# Altium project Audio Prj.PrjPcb
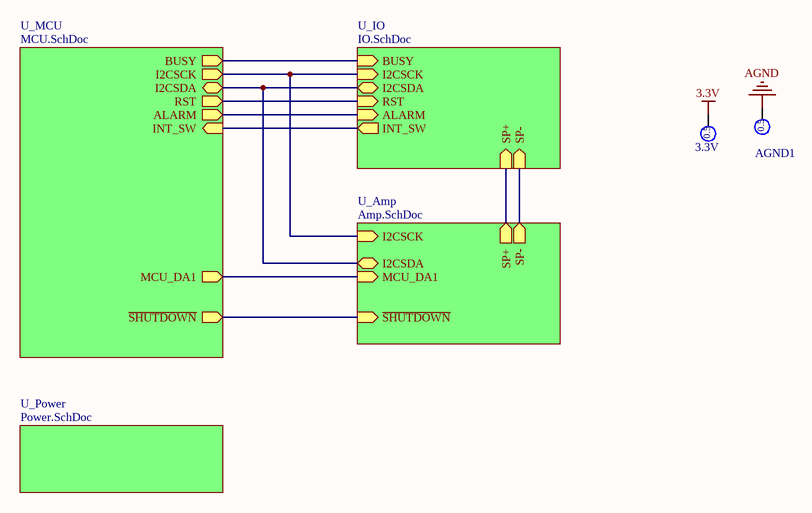
[diagram p0: TOP.SchDoc]
PRJ_Number: 202107; PRJ_Title: IHA-8001; SCH_Rev: 1.0
5 sheets, 279 parts. Net scope: hierarchical (ports join the sheet entries above them; power ports are global).
Board file: PCB2.PcbDoc
Sheets:
  TOP.SchDoc
    U_Amp = Amp.SchDoc
    U_MCU = MCU.SchDoc
    U_Power = Power.SchDoc
    U_IO = IO.SchDoc

## Sheet TOP.SchDoc: CX1000 5V4A
size A4; Date: 2012/02/27; ApprovedBy: 稲村; DrawnBy: 猪鼻; DocumentNumber: Documentnumber; Revision: 1; SheetNumber: 1; SheetTotal: 5; BoardNumber: BoardNumber; PartsNumber: PartsNumber; DrawnDate: 2012/02/27; ApprovedDate: 2012/**/**

### Parts
3.3V  TP0.5mm  [TP0.5mm]  (value not drawn)  (no BOM)
AGND1  TP0.5mm  [TP0.5mm]  (value not drawn)  (no BOM)

### Sub-sheets
U_Amp = Amp.SchDoc: SP+ (out), SP- (out), MCU_DA1 (in), ~{SHUTDOWN} (in), I2CSCK (in), I2CSDA (bidir)
U_IO = IO.SchDoc: SP+ (in), SP- (in), BUSY (in), I2CSCK (in), I2CSDA (bidir), INT_SW (out), RST (in), ALARM (in)
U_MCU = MCU.SchDoc: I2CSCK (out), I2CSDA (bidir), ALARM (out), BUSY (out), MCU_DA1 (out), RST (out), INT_SW (in), ~{SHUTDOWN} (out)
U_Power = Power.SchDoc: no entries

### Nets
3.3V: 3.3V.1
AGND: AGND1.1
ALARM: sheet U_MCU/ALARM, sheet U_IO/ALARM
BUSY: sheet U_MCU/BUSY, sheet U_IO/BUSY
I2CSCK: sheet U_Amp/I2CSCK, sheet U_MCU/I2CSCK, sheet U_IO/I2CSCK
I2CSDA: sheet U_Amp/I2CSDA, sheet U_MCU/I2CSDA, sheet U_IO/I2CSDA
INT_SW: sheet U_MCU/INT_SW, sheet U_IO/INT_SW
SP+: sheet U_Amp/SP+, sheet U_IO/SP+
SP-: sheet U_Amp/SP-, sheet U_IO/SP-
NetC58_1: sheet U_Amp/MCU_DA1, sheet U_MCU/MCU_DA1
NetR123_1: sheet U_Amp/~{SHUTDOWN}, sheet U_MCU/~{SHUTDOWN}
NetU2_44: sheet U_MCU/RST, sheet U_IO/RST

### Notes on the sheet
- Project Title:
- Project No:
- Size:
- Date:
- A4
- Rev:
- Page Title:
- Sheet:
- of
- (in symbol TP0.5mm) 0.5

### Library data of the parts
3.3V AGND1 = TP0.5mm: Test-Point 0.5mm

## Sheet Amp.SchDoc
size A4; SheetNumber: 4; SheetTotal: 5
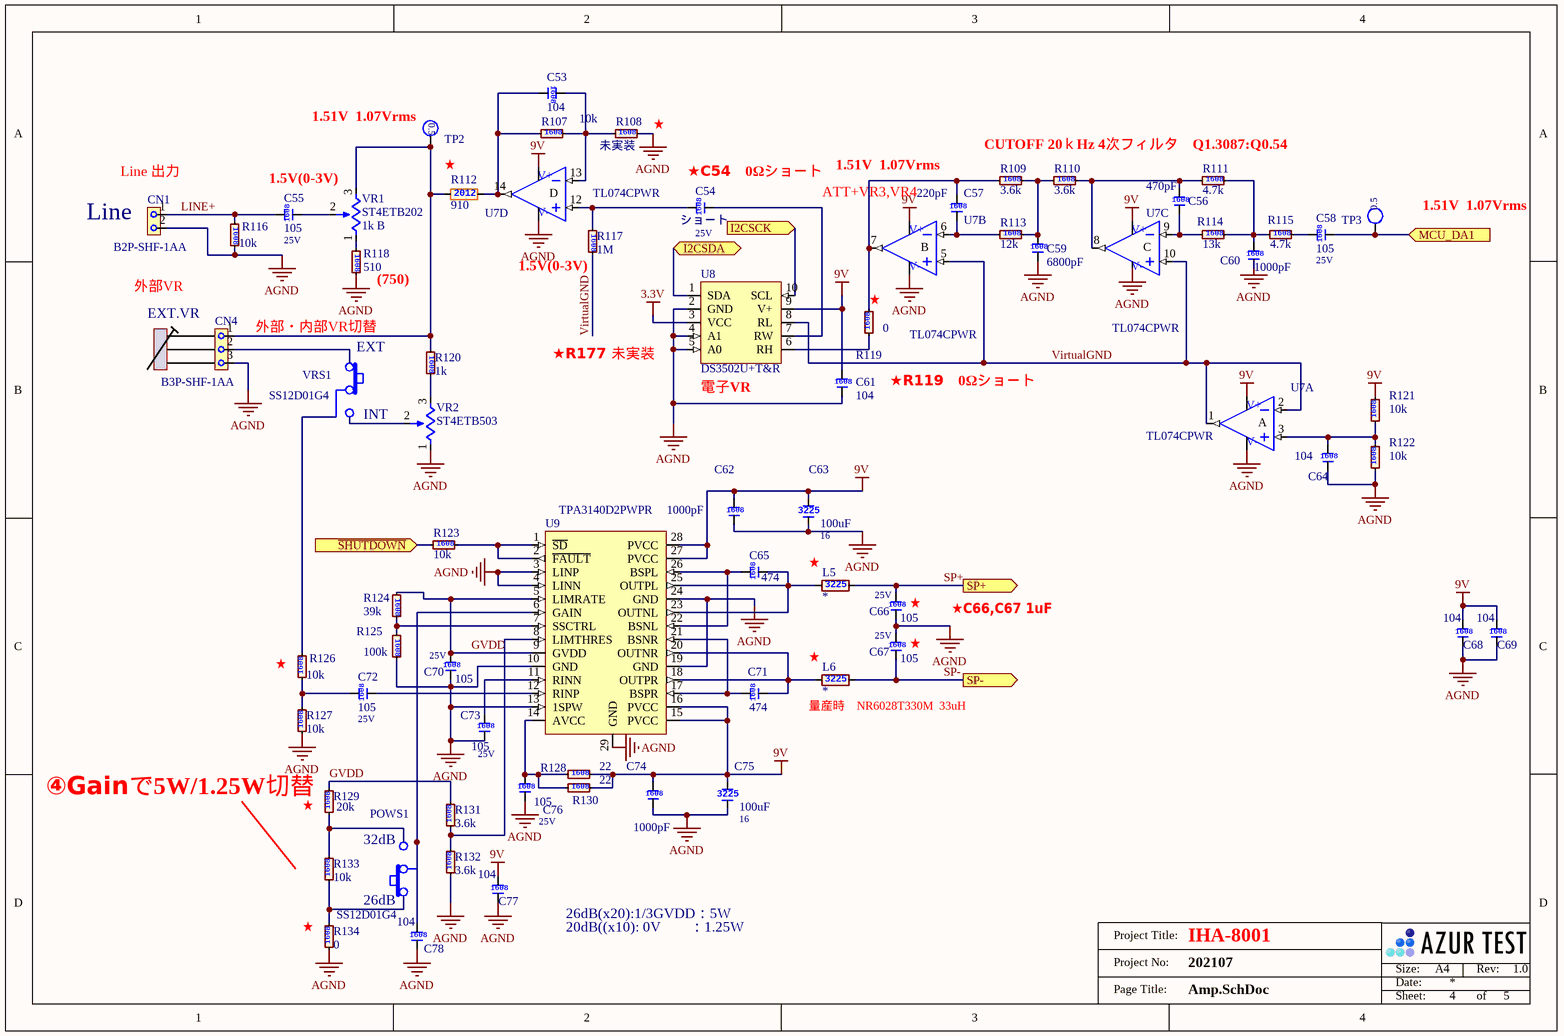
[diagram p1: Amp.SchDoc]

### Parts
C53  Tag: 104  [C1608]  (hidden comment: CGA3E2X7R1H104K080AA)
C54  Tag: ショート  Voltage: 25V  [C1608]  (hidden comment: TMK107BJ105MA-T)
C55  Tag: 105  Voltage: 25V  [C1608]  (hidden comment: TMK107BJ105MA-T)
C56  Tag: 470pF  [C1608]  (hidden comment: GCM1885C2A471JA16D)
C57  Tag: 220pF  [C1608]  (hidden comment: GCM1885C2A221JA16D)
C58  Tag: 105  Voltage: 25V  [C1608]  (hidden comment: TMK107BJ105MA-T)
C59  Tag: 6800pF  [C1608]  (hidden comment: GCM1885C2A682JA16D)
C60  Tag: 1000pF  [C1608]  (hidden comment: GCM1885C2A102JA16D)
C61  Tag: 104  [C1608]  (hidden comment: CGA3E2X7R1H104K080AA)
C62  Tag: 1000pF  [C1608]  (hidden comment: GCM1885C2A102JA16D)
C63  Tag: 100uF  Voltage: 16  [C3225]  (hidden comment: EMK325ABJ107MM-T)
C64  Tag: 104  [C1608]  (hidden comment: CGA3E2X7R1H104K080AA)
C65  Tag: 474  [C1608]  (hidden comment: UMK107B7474KA-TR)
C66  Tag: 105  Voltage: 25V  [C1608]  (hidden comment: TMK107BJ105MA-T)
C67  Tag: 105  Voltage: 25V  [C1608]  (hidden comment: TMK107BJ105MA-T)
C68  Tag: 104  [C1608]  (hidden comment: CGA3E2X7R1H104K080AA)
C69  Tag: 104  [C1608]  (hidden comment: CGA3E2X7R1H104K080AA)
C70  Tag: 105  Voltage: 25V  [C1608]  (hidden comment: TMK107BJ105MA-T)
C71  Tag: 474  [C1608]  (hidden comment: UMK107B7474KA-TR)
C72  Tag: 105  Voltage: 25V  [C1608]  (hidden comment: TMK107BJ105MA-T)
C73  Tag: 105  Voltage: 25V  [C1608]  (hidden comment: TMK107BJ105MA-T)
C74  Tag: 1000pF  [C1608]  (hidden comment: GCM1885C2A102JA16D)
C75  Tag: 100uF  Voltage: 16  [C3225]  (hidden comment: EMK325ABJ107MM-T)
C76  Tag: 105  Voltage: 25V  [C1608]  (hidden comment: TMK107BJ105MA-T)
C77  Tag: 104  [C1608]  (hidden comment: CGA3E2X7R1H104K080AA)
C78  Tag: 104  [C1608]  (hidden comment: CGA3E2X7R1H104K080AA)
CN1  B2P-SHF-1AA  [B2P-SHF-1AA]
CN4  B3P-SHF-1AA  [B3P-SHF-1AA]
L5  TF3225  [R3225]  (value not drawn)
L6  TF3225  [R3225]  (value not drawn)
POWS1  SS12D01G4  [SS12D01G4]
R107  Tag: 10k  [R1608]  (hidden comment: ERJ-PA3F1002V)
R108  Tag: 未実装  [R1608]  (hidden comment: ERJ-PA3F1002V)  (net tie, no BOM)
R109  Tag: 3.6k  [R1608]  (hidden comment: ERJ-PA3F3601V)
R110  Tag: 3.6k  [R1608]  (hidden comment: ERJ-PA3F3601V)
R111  Tag: 4.7k  [R1608]  (hidden comment: ERJ-PA3F4701V)
R112  Tag: 910  [R2012]  (hidden comment: ERJ-P08J911V)
R113  Tag: 12k  [R1608]  (hidden comment: ERJ-PA3F1201V)
R114  Tag: 13k  [R1608]  (hidden comment: ERJ-PA3F1302V)
R115  Tag: 4.7k  [R1608]  (hidden comment: ERJ-PA3F4701V)
R116  Tag: 10k  [R1608]  (hidden comment: ERJ-PA3F1002V)
R117  Tag: 1M  [R1608]  (hidden comment: ERJ-PA3F1004V)
R118  Tag: 510  [R1608]  (hidden comment: ERJ-PA3F5100V)
R119  Tag: 0  [R1608]  (hidden comment: ERJ-S030R00V)
R120  Tag: 1k  [R1608]  (hidden comment: ERJ-PA3F1001V)
R121  Tag: 10k  [R1608]  (hidden comment: ERJ-PA3F1002V)
R122  Tag: 10k  [R1608]  (hidden comment: ERJ-PA3F1002V)
R123  Tag: 10k  [R1608]  (hidden comment: ERJ-PA3F1002V)
R124  Tag: 39k  [R1608]  (hidden comment: ERJ-PA3F3902V)
R125  Tag: 100k  [R1608]  (hidden comment: ERJ-PA3F3902V)
R126  Tag: 10k  [R1608]  (hidden comment: ERJ-PA3F1002V)
R127  Tag: 10k  [R1608]  (hidden comment: ERJ-PA3F1002V)
R128  Tag: 22  [R1608]  (hidden comment: ERJ-PA3F22R0V)
R129  Tag: 20k  [R1608]  (hidden comment: ERJ-PA3F2002V)
R130  Tag: 22  [R1608]  (hidden comment: ERJ-PA3F22R0V)
R131  Tag: 3.6k  [R1608]  (hidden comment: ERJ-PA3F3601V)
R132  Tag: 3.6k  [R1608]  (hidden comment: ERJ-PA3F3601V)
R133  Tag: 10k  [R1608]  (hidden comment: ERJ-PA3F1002V)
R134  Tag: 0  [R1608]  (hidden comment: ERJ-S030R00V)
TP2  TP0.5mm  [TP0.5mm]  (value not drawn)  (no BOM)
TP3  TP0.5mm  [TP0.5mm]  (value not drawn)  (no BOM)
U7  TL074CPWR  [TSSOP14]  (parts A,B,C,D of 4)
U8  DS3502U+T&R  [MSOP10]
U9  TPA3140D2PWPR  [TSSOP28]
VR1  ST4ETB202  Tag: 1k B  [ST4ETB202]
VR2  ST4ETB503  [ST4ETB202]
VRS1  SS12D01G4  [SS12D01G4]

### Ports
I2CSCK (in), I2CSDA (bidir), MCU_DA1 (in), SP+ (out), SP- (out), ~{SHUTDOWN} (in)

### Nets
3.3V: U8.3(VCC)
9V: C61.2 C62.2 C63.2 C68.2 C69.2 C74.2 C75.2 C77.2 R121.2 R128.2 R130.2 U7.4(V+) U8.9(V+) U9.15(PVCC) U9.16(PVCC) U9.27(PVCC) U9.28(PVCC)
AGND: C59.1 C60.1 C61.1 C62.1 C63.1 C64.1 C66.1 C67.2 C68.1 C69.1 C70.1 C73.1 C74.1 C75.1 C76.1 C77.1 C78.1 CN1.2 CN4.3 R108.2 R116.2 R118.2 R122.1 R125.2 R127.1 R132.1 R134.1 U7.11(V-) U8.2(GND) U8.4(A1) U8.5(A0) U9.3(LINP) U9.4(LINN) U9.10(GND) U9.13(1SPW) U9.19(GND) U9.24(GND) U9.29(GND) VR2.1
GVDD: C70.2 R124.1 R129.2 R131.2 U9.5(LIMRATE) U9.9(GVDD)
I2CSCK: U8.10(SCL) ; port I2CSCK
I2CSDA: U8.1(SDA) ; port I2CSDA
LINE+: C55.2 CN1.1 R116.1
SP+: C66.2 L5.2 ; port SP+
SP-: C67.1 L6.2 ; port SP-
VirtualGND: R117.2 U7.1(OUT) U7.2(IN-) U7.5(IN+) U7.10(IN+) U8.8(RL)
NetC53_1: C53.1 R107.1 R112.2 U7.14(OUT)
NetC53_2: C53.2 R107.2 R108.1 U7.13(IN-)
NetC54_1: C54.1 U8.7(RW)
NetC54_2: C54.2 R117.1 U7.12(IN+)
NetC55_1: C55.1 VR1.2
NetC56_1: C56.1 R114.1 U7.9(IN-)
NetC56_2: C56.2 R110.2 R111.1 U7.8(OUT)
NetC57_1: C57.1 R113.1 U7.6(IN-)
NetC57_2: C57.2 R109.1 R119.2 U7.7(OUT)
NetC58_1: C58.1 TP3.1 ; port MCU_DA1
NetC58_2: C58.2 R115.2
NetC59_2: C59.2 R109.2 R110.1 R113.2
NetC60_2: C60.2 R111.2 R114.2 R115.1
NetC64_2: C64.2 R121.1 R122.2 U7.3(IN+)
NetC65_1: C65.1 L5.1 U9.23(OUTNL) U9.25(OUTPL)
NetC65_2: C65.2 U9.22(BSNL) U9.26(BSPL)
NetC71_1: C71.1 L6.1 U9.18(OUTPR) U9.20(OUTNR)
NetC71_2: C71.2 U9.17(BSPR) U9.21(BSNR)
NetC72_1: C72.1 U9.12(RINP)
NetC72_2: C72.2 R126.1 R127.2
NetC73_2: C73.2 U9.11(RINN)
NetC76_2: C76.2 R128.1 R130.1 U9.14(AVCC)
NetC78_2: C78.2 POWS1.2 U9.6(GAIN)
NetCN4_1: CN4.1 R112.1 R120.1 TP2.1 VR1.3
NetCN4_2: CN4.2 VRS1.1
NetPOWS1_1: POWS1.1 R133.1 R134.2
NetPOWS1_3: POWS1.3 R129.1 R133.2
NetR118_1: R118.1 VR1.1
NetR119_1: R119.1 U8.6(RH)
NetR120_2: R120.2 VR2.3
NetR123_1: R123.1 ; port ~{SHUTDOWN}
NetR123_2: R123.2 U9.1(~{SD}) U9.2(~{FAULT})
NetR124_2: R124.2 R125.1 U9.7(SSCTRL)
NetR126_2: R126.2 VRS1.2
NetR131_1: R131.1 R132.2 U9.8(LIMTHRES)
NetVR2_2: VR2.2 VRS1.3

### Notes on the sheet
- (near CN1) Line 出力
- (near TP2) 1.51V  1.07Vrms
- ★
- (near R108) ★
- (near C54) ★C54　0Ωショート
- (near C57) 1.51V  1.07Vrms
- CUTOFF 20ｋHz 4次フィルタ　Q1.3087:Q0.54
- (near CN1) Line
- (near VR1) 1.5V(0-3V)
- (near C54) ATT+VR3,VR4
- (near TP3) 1.51V  1.07Vrms
- 外部VR
- (near R118) (750)
- 1.5V(0-3V)
- (near R119) ★
- (near CN4) EXT.VR
- 外部・内部VR切替
- (near VRS1) EXT
- ★R177 未実装
- ★R119　0Ωショート
- (near VRS1) INT
- (near U8) 電子VR
- (near L5) ★
- (near C66) ★
- (near C67) ★
- ★C66,C67 1uF
- (near R126) ★
- (near L6) ★
- (near L6) 量産時　NR6028T330M  33uH
- ④Gainで5W/1.25W切替
- (near R129) ★
- (near POWS1) 32dB
- (near POWS1) 26dB
- 26dB(x20):1/3GVDD：5W
- (near R134) ★
- 20dB((x10): 0V　　：1.25W
- Labels drawn without touching a wire or pin: AGND
- Project Title:
- Project No:
- Size:
- Date:
- A4
- Rev:
- Page Title:
- Sheet:
- of
- (in symbol C1608) 1608
- (in symbol C3225) 3225
- (in symbol MF2012) 2012
- (in symbol TF1608) 1608
- (in symbol TF3225) 3225
- (in symbol TL084CPT, part A) A
- (in symbol TL084CPT, part B) B
- (in symbol TL084CPT, part C) C
- (in symbol TL084CPT, part D) D
- (in symbol TP0.5mm) 0.5

### Library data of the parts
C53 C61 C64 C68 C69 C77 C78 = C1608: セラコン1608サイズ; Vendor: TDK; Voltage: 50V
C54 C55 C58 C66 C67 C70 C72 C73 C76 = C1608: セラコン1608サイズ; Vendor: TaiyoYuden
C56 C57 C59 C60 C62 C74 = C1608: セラコン1608サイズ; Vendor: Murata; Voltage: 100V
C63 C75 = C3225: セラコン3225サイズ; Vendor: TaiyoYuden
C65 C71 = C1608: セラコン1608サイズ; Vendor: TiyoYuden; Voltage: 25V
CN1 = B2P-SHF-1AA: 雄,ストレート,1列2ピン; Vendor: JST
CN4 = B3P-SHF-1AA: 雄,ストレート,1列3ピン; Vendor: JST
L5 L6 = TF3225: 厚膜チップ抵抗3225サイズ; Vendor: *; Tag: *
POWS1 VRS1 = SS12D01G4: SPDTスライドスイッチ; Vendor: 秋月¦
R107-R111 R113-R134 = TF1608: 厚膜チップ抵抗1608サイズ; Vendor: Panasonic
R112 = MF2012: 薄膜チップ抵抗2012サイズ; Vendor: Panasonic
TP2 TP3 = TP0.5mm: Test-Point 0.5mm
U7 = TL084CPT: IC OPAMP JFET 4 CIRCUIT 14TSSOP; Vendor: Texas Instruments
U8 = DS3502U+T&R: IC DGTL POT 10KOHM 128TAP 10UMAX; Vendor: Maxim Integrated
U9 = TPA3140D2PWPR: IC AMP CLASS D STER 10W 28HTSSOP; Vendor: Texas Instruments
VR1 = ST-32EA**: CERMET TRIMMER  Top adjustmet; Vendor: Copal
VR2 = ST-32EA**: CERMET TRIMMER  Top adjustmet; Vendor: Copal; Tag: ***

## Sheet MCU.SchDoc
size A3; SheetNumber: 3; SheetTotal: 5
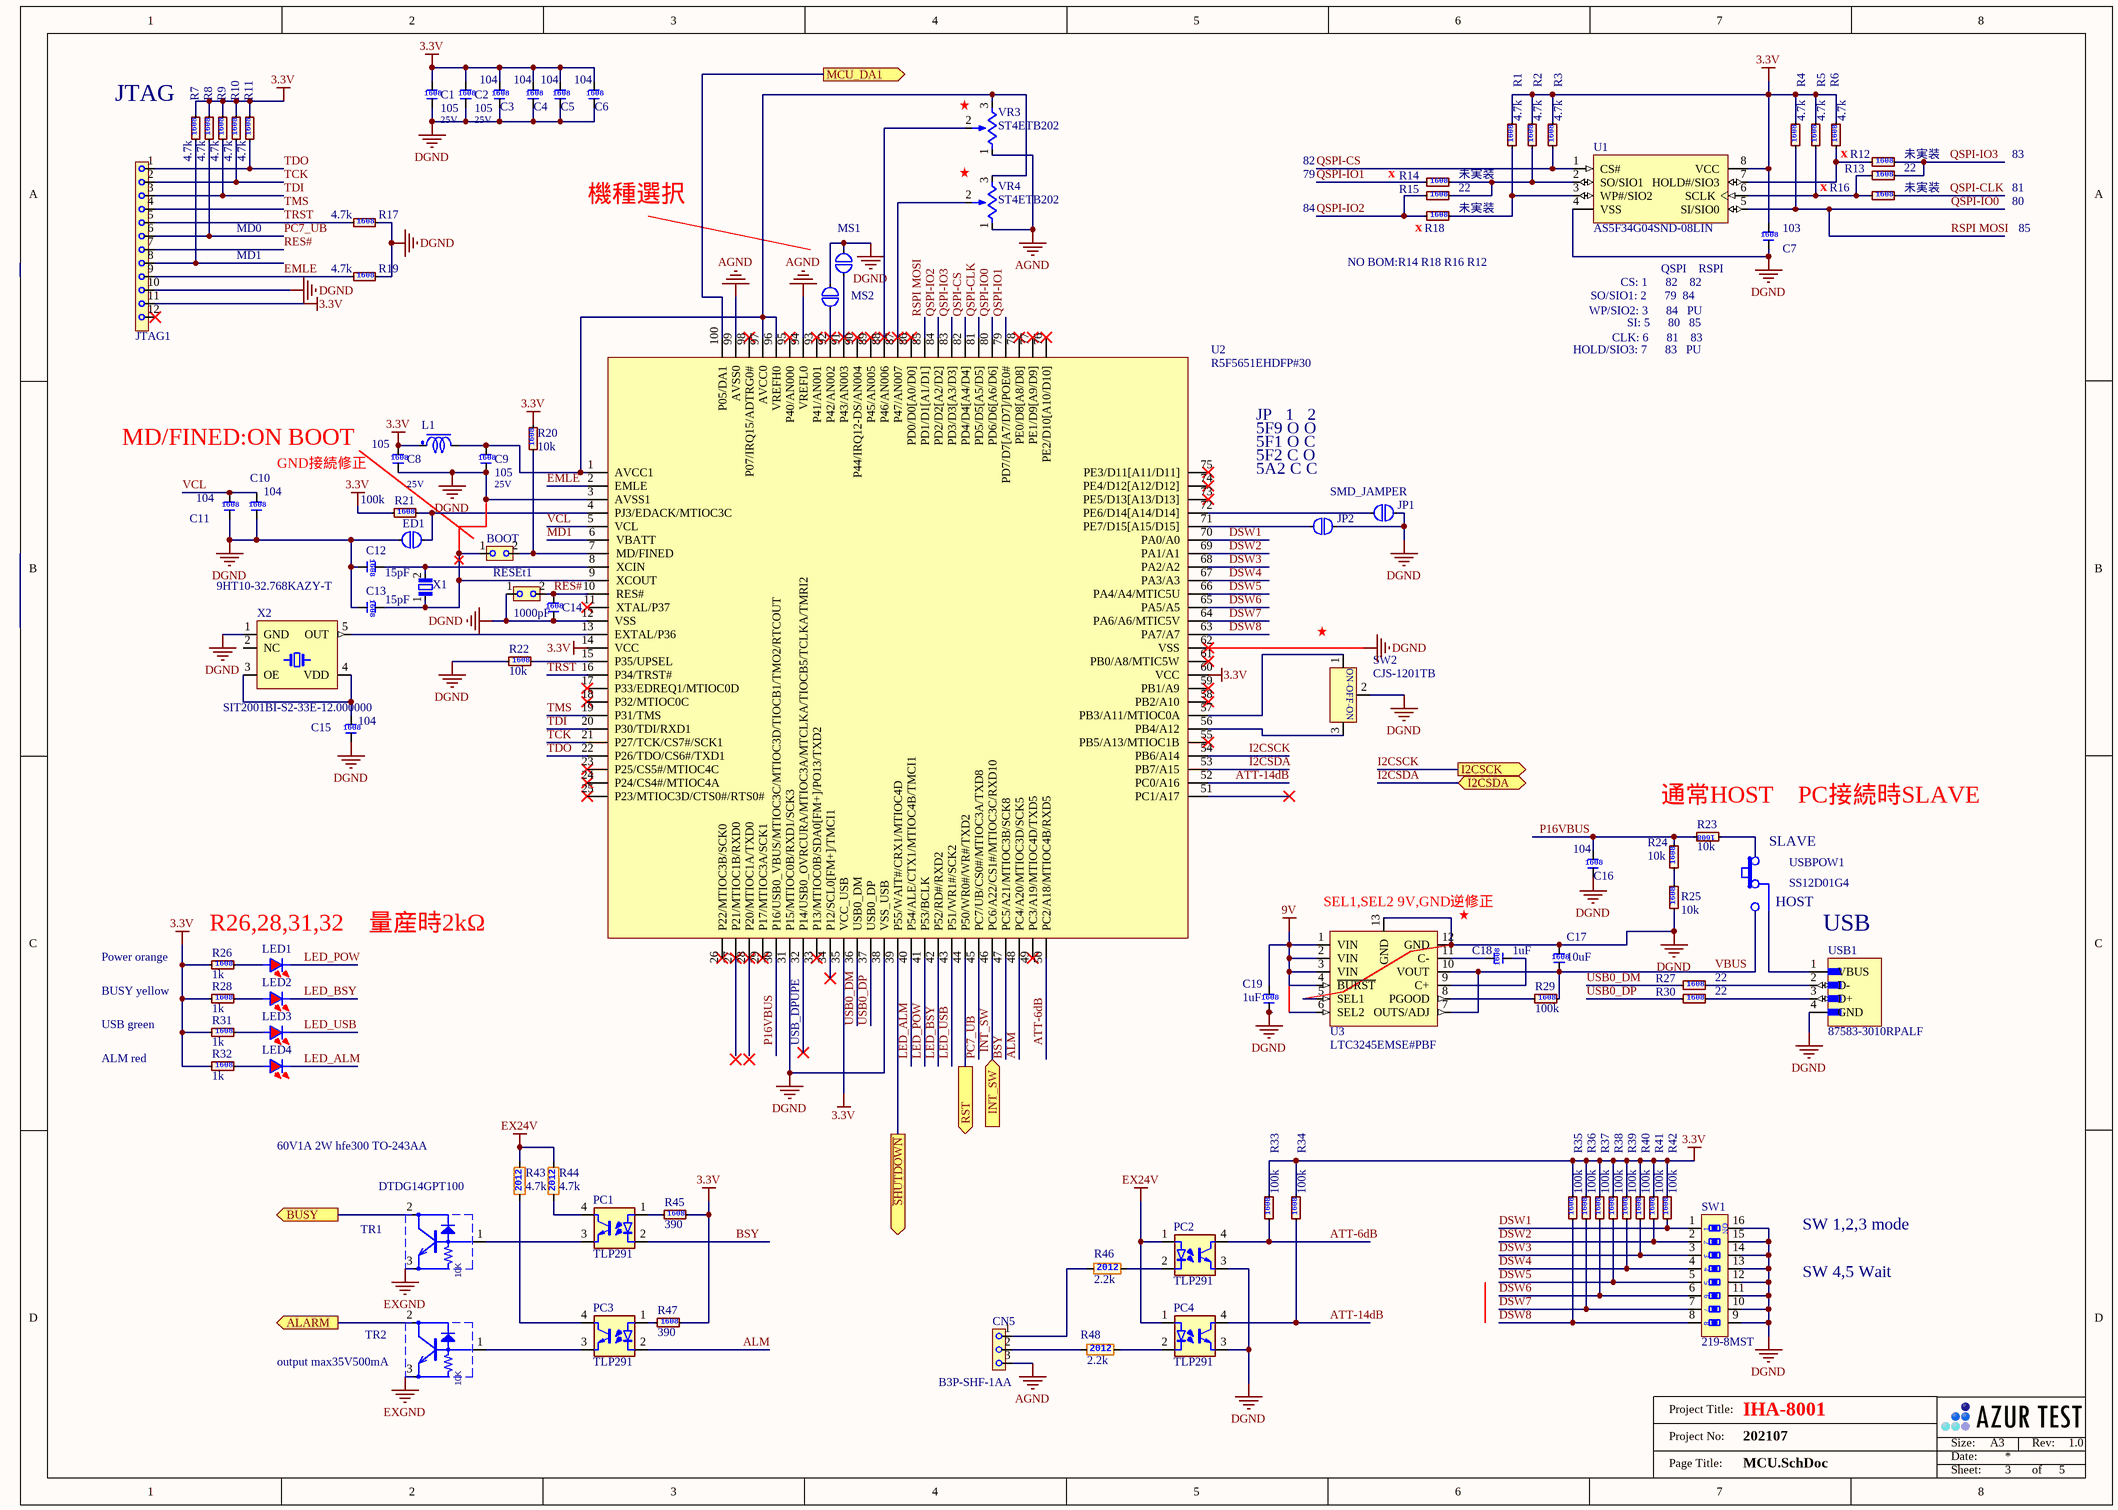
[diagram p2: MCU.SchDoc]

### Parts
BOOT  HEDDER2 2mm  [HDR1X2 2mm]  (value not drawn)
C1  Tag: 105  Voltage: 25V  [C1608]  (hidden comment: TMK107BJ105MA-T)
C2  Tag: 105  Voltage: 25V  [C1608]  (hidden comment: TMK107BJ105MA-T)
C3  Tag: 104  [C1608]  (hidden comment: CGA3E2X7R1H104K080AA)
C4  Tag: 104  [C1608]  (hidden comment: CGA3E2X7R1H104K080AA)
C5  Tag: 104  [C1608]  (hidden comment: CGA3E2X7R1H104K080AA)
C6  Tag: 104  [C1608]  (hidden comment: CGA3E2X7R1H104K080AA)
C7  Tag: 103  [C1608]  (hidden comment: GCD188R71H103KA01D)
C8  Tag: 105  Voltage: 25V  [C1608]  (hidden comment: TMK107BJ105MA-T)
C9  Tag: 105  Voltage: 25V  [C1608]  (hidden comment: TMK107BJ105MA-T)
C10  Tag: 104  [C1608]  (hidden comment: CGA3E2X7R1H104K080AA)
C11  Tag: 104  [C1608]  (hidden comment: CGA3E2X7R1H104K080AA)
C12  Tag: 15pF  [C1608]  (hidden comment: GCM1885C2A150FA16D)
C13  Tag: 15pF  [C1608]  (hidden comment: GCM1885C2A150FA16D)
C14  Tag: 1000pF  [C1608]  (hidden comment: GCM1885C2A102JA16D)
C15  Tag: 104  [C1608]  (hidden comment: CGA3E2X7R1H104K080AA)
C16  Tag: 104  [C1608]  (hidden comment: CGA3E2X7R1H104K080AA)
C17  Tag: 10uF  [C1608]  (hidden comment: CGA3E2X7R1H104K080AA)
C18  Tag: 1uF  [C1608]  (hidden comment: CGA3E2X7R1H104K080AA)
C19  Tag: 1uF  [C1608]  (hidden comment: CGA3E2X7R1H104K080AA)
CN5  B3P-SHF-1AA  [B3P-SHF-1AA]
ED1  SMD_JAMPER  [SMD_JAMPER -Cut]  (value not drawn)  (no BOM)
JP1  SMD_JAMPER  [SMD_JAMPER -Cut]  (no BOM)
JP2  SMD_JAMPER  [SMD_JAMPER -Cut]  (value not drawn)  (no BOM)
JTAG1  HEDDER12 2mm  [HDR1X12 2mm]  (value not drawn)
L1  MLZ2012N101LT000  [R2012]  (value not drawn)
LED1  APT1608LSECK/J4-PRV  [LED1608]  (value not drawn)
LED2  APT1608LSYCK/J3-PRV  [LED1608]  (value not drawn)
LED3  APT1608LZGCK  [LED1608]  (value not drawn)
LED4  APT1608LSECK/J3-PRV  [LED1608]  (value not drawn)
MS1  SMD_JAMPER  [SMD_JAMPER -Cut]  (value not drawn)  (no BOM)
MS2  SMD_JAMPER  [SMD_JAMPER -Cut]  (value not drawn)  (no BOM)
PC1  TLP291  [SOP4]
PC2  TLP291  [SOP4]
PC3  TLP291  [SOP4]
PC4  TLP291  [SOP4]
R1  Tag: 4.7k  [R1608]  (hidden comment: ERJ-PA3F4701V)
R2  Tag: 4.7k  [R1608]  (hidden comment: ERJ-PA3F4701V)
R3  Tag: 4.7k  [R1608]  (hidden comment: ERJ-PA3F4701V)
R4  Tag: 4.7k  [R1608]  (hidden comment: ERJ-PA3F4701V)
R5  Tag: 4.7k  [R1608]  (hidden comment: ERJ-PA3F4701V)
R6  Tag: 4.7k  [R1608]  (hidden comment: ERJ-PA3F4701V)
R7  Tag: 4.7k  [R1608]  (hidden comment: ERJ-PA3F4701V)
R8  Tag: 4.7k  [R1608]  (hidden comment: ERJ-PA3F4701V)
R9  Tag: 4.7k  [R1608]  (hidden comment: ERJ-PA3F4701V)
R10  Tag: 4.7k  [R1608]  (hidden comment: ERJ-PA3F4701V)
R11  Tag: 4.7k  [R1608]  (hidden comment: ERJ-PA3F4701V)
R12  Tag: 未実装  [R1608]  (hidden comment: ERJ-PA3F22R0V)  (net tie, no BOM)
R13  Tag: 22  [R1608]  (hidden comment: ERJ-PA3F22R0V)
R14  Tag: 未実装  [R1608]  (hidden comment: ERJ-PA3F22R0V)  (net tie, no BOM)
R15  Tag: 22  [R1608]  (hidden comment: ERJ-PA3F22R0V)
R16  Tag: 未実装  [R1608]  (hidden comment: ERJ-PA3F22R0V)  (net tie, no BOM)
R17  Tag: 4.7k  [R1608]  (hidden comment: ERJ-PA3F4701V)
R18  Tag: 未実装  [R1608]  (hidden comment: ERJ-PA3F22R0V)  (net tie, no BOM)
R19  Tag: 4.7k  [R1608]  (hidden comment: ERJ-PA3F4701V)
R20  Tag: 10k  [R1608]  (hidden comment: ERJ-PA3F1002V)
R21  Tag: 100k  [R1608]  (hidden comment: ERJ-PA3F1003V)
R22  Tag: 10k  [R1608]  (hidden comment: ERJ-PA3F1002V)
R23  Tag: 10k  [R1608]  (hidden comment: ERJ-PA3F1002V)
R24  Tag: 10k  [R1608]  (hidden comment: ERJ-PA3F1002V)
R25  Tag: 10k  [R1608]  (hidden comment: ERJ-PA3F1002V)
R26  Tag: 1k  [R1608]  (hidden comment: ERJ-PA3F1001V)
R27  Tag: 22  [R1608]  (hidden comment: ERJ-PA3F22R0V)
R28  Tag: 1k  [R1608]  (hidden comment: ERJ-PA3F1001V)
R29  Tag: 100k  [R1608]  (hidden comment: ERJ-PA3F1501V)
R30  Tag: 22  [R1608]  (hidden comment: ERJ-PA3F22R0V)
R31  Tag: 1k  [R1608]  (hidden comment: ERJ-PA3F1001V)
R32  Tag: 1k  [R1608]  (hidden comment: ERJ-PA3F1001V)
R33  Tag: 100k  [R1608]  (hidden comment: ERJ-PA3F1003V)
R34  Tag: 100k  [R1608]  (hidden comment: ERJ-PA3F1003V)
R35  Tag: 100k  [R1608]  (hidden comment: ERJ-PA3F1003V)
R36  Tag: 100k  [R1608]  (hidden comment: ERJ-PA3F1003V)
R37  Tag: 100k  [R1608]  (hidden comment: ERJ-PA3F1003V)
R38  Tag: 100k  [R1608]  (hidden comment: ERJ-PA3F1003V)
R39  Tag: 100k  [R1608]  (hidden comment: ERJ-PA3F1003V)
R40  Tag: 100k  [R1608]  (hidden comment: ERJ-PA3F1003V)
R41  Tag: 100k  [R1608]  (hidden comment: ERJ-PA3F1003V)
R42  Tag: 100k  [R1608]  (hidden comment: ERJ-PA3F1003V)
R43  Tag: 4.7k  [R2012]  (hidden comment: ERJ-P08J472V)
R44  Tag: 4.7k  [R2012]  (hidden comment: ERJ-P08J472V)
R45  Tag: 390  [R1608]  (hidden comment: ERJ-PA3F3900V)
R46  Tag: 2.2k  [R2012]  (hidden comment: ERJ-P08J222V)
R47  Tag: 390  [R1608]  (hidden comment: ERJ-PA3F3900V)
R48  Tag: 2.2k  [R2012]  (hidden comment: ERJ-P08J222V)
RESEt1  HEDDER2 2mm  [HDR1X2 2mm]  (value not drawn)
SW1  219-8MST  [219-8MST]
SW2  CJS-1201TB  [Slide Switch SPDT]
TR1  DTDG14GPT100  [SOT-89-3]
TR2  DTDG14GPT100  [SOT-89-3]  (value not drawn)
U1  AS5F34G04SND-08LIN  [8LGA(6x8)]
U2  R5F5651EHDFP#30  [LQFP100]
U3  LTC3245EMSE#PBF  [MSOP12]
USB1  87583-3010RPALF  [USB_2.0]
USBPOW1  SS12D01G4  [SS12D01G4]
VR3  ST4ETB202  [ST4ETB202]
VR4  ST4ETB202  [ST4ETB202]
X1  9HT10-32.768KAZY-T  [9HT10]
X2  SIT2001BI-S2-33E-12.000000  [SOT-23-5]

### Ports
ALARM (out), BUSY (out), I2CSCK (out), I2CSDA (bidir), INT_SW (in), MCU_DA1 (out), RST (out), ~{SHUTDOWN} (out)

### Nets
3.3V: C1.2 C2.2 C3.2 C4.2 C5.2 C6.2 C7.2 C8.2 JTAG1.11 L1.1 R1.2 R2.2 R3.2 R4.2 R5.2 R6.2 R7.2 R8.2 R9.2 R10.2 R11.2 R20.2 R21.1 R26.1 R28.1 R31.1 R32.1 R33.2 R34.2 R35.2 R36.2 R37.2 R38.2 R39.2 R40.2 R41.2 R42.2 R45.2 R47.2 U1.8(VCC) U2.14(VCC) U2.35(VCC_USB) U2.60(VCC)
9V: C19.2 U3.1(VIN) U3.2(VIN) U3.3(VIN) U3.4(~{BURST})
AGND: CN5.3 U2.94(VREFL0) U2.99(AVSS0) VR3.1 VR4.1
DGND: BOOT.1 C1.1 C2.1 C3.1 C4.1 C5.1 C6.1 C7.1 C8.1 C9.1 C10.1 C11.1 C12.1 C13.1 C13.2 C14.1 C15.1 C16.1 C17.2 C19.1 ED1.1 JP1.2 JP2.2 JTAG1.10 MS1.1 MS2.1 PC2.3(E) PC4.3(E) R17.2 R19.2 R22.1 R25.1 RESEt1.1 SW1.9 SW1.10 SW1.11 SW1.12 SW1.13 SW1.14 SW1.15 SW1.16 SW2.2 U1.4(VSS) U2.3(AVSS1) U2.9(XCOUT) U2.12(VSS) U2.31(P15/MTIOC0B/RXD1/SCK3) U2.38(VSS_USB) U3.12(GND) U3.13(GND) USB1.4(GND) X1.1 X2.1(GND)
EX24V: PC2.1(A-LED) PC4.1(A-LED) R43.2 R44.2
EXGND: TR1.3(OUT) TR2.3(OUT)
ALARM: TR2.2(GND) ; port ALARM
ALM: PC3.2(K-LED) U2.48(PC4/A20/MTIOC3D/SCK5)
ATT-6dB: PC2.4(C) R33.1 U2.50(PC2/A18/MTIOC4B/RXD5)
ATT-14dB: PC4.4(C) R34.1 U2.52(PC0/A16)
BSY: PC1.2(K-LED) U2.47(PC5/A21/MTIOC3B/SCK8)
BUSY: TR1.2(GND) ; port BUSY
DSW1: R42.1 SW1.1 U2.70(PA0/A0)
DSW2: R41.1 SW1.2 U2.69(PA1/A1)
DSW3: R40.1 SW1.3 U2.68(PA2/A2)
DSW4: R39.1 SW1.4 U2.67(PA3/A3)
DSW5: R38.1 SW1.5 U2.66(PA4/A4/MTIC5U)
DSW6: R37.1 SW1.6 U2.65(PA5/A5)
DSW7: R36.1 SW1.7 U2.64(PA6/A6/MTIC5V)
DSW8: R35.1 SW1.8 U2.63(PA7/A7)
EMLE: JTAG1.9 R19.1 U2.2(EMLE)
I2CSCK: U2.54(PB6/A14) ; port I2CSCK
I2CSDA: U2.53(PB7/A15) ; port I2CSDA
INT_SW: U2.46(PC6/A22/CS1#/MTIOC3C/RXD10) ; port INT_SW
LED_ALM: LED4.K U2.40(P54/ALE/CTX1/MTIOC4B/TMCI1)
LED_BSY: LED2.K U2.42(P52/RD#/RXD2)
LED_POW: LED1.K U2.41(P53/BCLK)
LED_USB: LED3.K U2.43(P51/WR1#/SCK2)
MD1: U2.6(VBATT)
P16VBUS: C16.2 R23.2 R24.2 U2.30(P16/USB0_VBUS/MTIOC3C/MTIOC3D/TIOCB1/TMO2/RTCOUT)
PC7_UB: JTAG1.6 R8.1 U2.45(PC7/UB/CS0#/MTIOC3A/TXD8)
QSPI-CLK: R16.2 U2.81(PD5/D5[A5/D5])
QSPI-CS: R3.1 U1.1(CS#) U2.82(PD4/D4[A4/D4])
QSPI-IO0: R4.1 U1.5(SI/SIO0) U2.80(PD6/D6[A6/D6]) U2.85(PD1/D1[A1/D1])  [also labelled RSPI MOSI]
QSPI-IO1: R14.1 U2.79(PD7/D7[A7/D7]/POE0#)
QSPI-IO2: R15.1 R18.1 U2.84(PD2/D2[A2/D2])
QSPI-IO3: R12.2 R13.2 U2.83(PD3/D3[A3/D3])
RES#: C14.2 JTAG1.7 RESEt1.2 U2.10(RES#)
TCK: JTAG1.2 R10.1 U2.21(P27/TCK/CS7#/SCK1)
TDI: JTAG1.3 R9.1 U2.20(P30/TDI/RXD1)
TDO: JTAG1.1 R11.1 U2.22(P26/TDO/CS6#/TXD1)
TMS: JTAG1.4 U2.19(P31/TMS)
TRST: JTAG1.5 R17.1 U2.16(P34/TRST#)
USB0_DM: R27.1 U2.36(USB0_DM)
USB0_DP: R30.1 U2.37(USB0_DP)
VBUS: C17.1 R29.2 U3.7(OUTS/ADJ) U3.10(VOUT) USBPOW1.3
VCL: C10.2 C11.2 U2.5(VCL)
NetBOOT_2: BOOT.2 R20.1 U2.7(MD/FINED)
NetC9_2: C9.2 L1.2 U2.1(AVCC1) U2.96(VREFH0) U2.97(AVCC0) VR3.3 VR4.3
NetC12_2: C12.2 U2.8(XCIN) X1.2
NetC15_2: C15.2 X2.3(OE) X2.4(VDD)
NetC18_1: C18.1 U3.9(C+)
NetC18_2: C18.2 U3.11(C-)
NetC58_1: U2.100(P05/DA1) ; port MCU_DA1
NetCN5_1: CN5.1 R46.1
NetCN5_2: CN5.2 R48.1
NetED1_2: ED1.2 R21.2 U2.4(PJ3/EDACK/MTIOC3C)
NetJP1_1: JP1.1 U2.72(PE6/D14[A14/D14])
NetJP2_1: JP2.1 U2.71(PE7/D15[A15/D15])
NetJTAG1_8: JTAG1.8 R7.1
NetLED1_A: LED1.A R26.2
NetLED2_A: LED2.A R28.2
NetLED3_A: LED3.A R31.2
NetLED4_A: LED4.A R32.2
NetMS1_2: MS1.2 U2.91(P43/AN003)
NetMS2_2: MS2.2 U2.92(P42/AN002)
NetPC1_1: PC1.1(A-LED) R45.1
NetPC1_3: PC1.3(E) TR1.1(IN)
NetPC1_4: PC1.4(C) R44.1
NetPC2_2: PC2.2(K-LED) R46.2
NetPC3_1: PC3.1(A-LED) R47.1
NetPC3_3: PC3.3(E) TR2.1(IN)
NetPC3_4: PC3.4(C) R43.1
NetPC4_2: PC4.2(K-LED) R48.2
NetR1_1: R1.1 R18.2 U1.3(WP#/SIO2)
NetR2_1: R2.1 R14.2 R15.2 U1.2(SO/SIO1)
NetR5_1: R5.1 R13.1 R16.1 U1.6(SCLK)
NetR6_1: R6.1 R12.1 U1.7(HOLD#/SIO3)
NetR22_2: R22.2 U2.15(P35/UPSEL)
NetR23_1: R23.1 USBPOW1.1
NetR24_1: R24.1 R25.2
NetR27_2: R27.2 USB1.2(D-)
NetR29_1: R29.1 U3.8(PGOOD)
NetR30_2: R30.2 USB1.3(D+)
NetR123_1: U2.39(P55/WAIT#/CRX1/MTIOC4D) ; port ~{SHUTDOWN}
NetSW2_1: SW2.1 U2.57(PB3/A11/MTIOC0A)
NetSW2_3: SW2.3 U2.56(PB4/A12)
NetU2_13: U2.13(EXTAL/P36) X2.5(OUT)
NetU2_44: U2.44(P50/WR0#/WR#/TXD2) ; port RST
NetU2_87: U2.87(P47/AN007) VR4.2
NetU2_88: U2.88(P46/AN006) VR3.2
NetUSB1_1: USB1.1(VBUS) USBPOW1.2

Not connected (* = marked no-connect by the designer): JTAG1 12*; U2 11(XTAL/P37)* 17(P33/EDREQ1/MTIOC0D)* 18(P32/MTIOC0C)* 23(P25/CS5#/MTIOC4C)* 24(P24/CS4#/MTIOC4A)* 25(P23/MTIOC3D/CTS0#/RTS0#)* 26(P22/MTIOC3B/SCK0)* 27(P21/MTIOC1B/RXD0)* 28(P20/MTIOC1A/TXD0)* 29(P17/MTIOC3A/SCK1)* 32(P14/USB0_OVRCURA/MTIOC3A/MTCLKA/TIOCB5/TCLKA/TMRI2)* 33(P13/MTIOC0B/SDA0[FM+]/PO13/TXD2)* 34(P12/SCL0[FM+]/TMCI1)* 49(PC3/A19/MTIOC4D/TXD5)* 51(PC1/A17)* 55(PB5/A13/MTIOC1B)* 58(PB2/A10)* 59(PB1/A9)* 61(PB0/A8/MTIC5W)* 62(VSS)* 73(PE5/D13[A13/D13])* 74(PE4/D12[A12/D12])* 75(PE3/D11[A11/D11])* 76(PE2/D10[A10/D10])* 77(PE1/D9[A9/D9])* 78(PE0/D8[A8/D8])* 86(PD0/D0[A0/D0])* 89(P45/AN005)* 90(P44/IRQ12-DS/AN004)* 93(P41/AN001)* 95(P40/AN000)* 98(P07/IRQ15/ADTRG0#)*; U3 5(SEL1) 6(SEL2); X2 2(NC)

### Notes on the sheet
- JTAG
- (near VR3) ★
- (near VR4) ★
- 79
- 82
- x
- (near R6) x
- 83
- MD0
- 機種選択
- 84
- (near R18) x
- 80
- 81
- 85
- MD1
- NO BOM:R14 R18 R16 R12
- WP/SIO2: 3      84   PU
- SO/SIO1: 2      79  84
- CS: 1      82    82
- QSPI    RSPI
- HOLD/SIO3: 7      83   PU
- CLK: 6      81    83
- SI: 5      80   85
- MD/FINED:ON BOOT
- 5F9 O O
- 5F1 O C
- JP   1   2
- GND接続修正
- 5F2 C O
- 5A2 C C
- (near SW2) ★
- 通常HOST　PC接続時SLAVE
- (near USBPOW1) SLAVE
- (near U3) SEL1,SEL2 9V,GND逆修正
- (near U3) ★
- (near USBPOW1) HOST
- Power orange
- BUSY yellow
- R26,28,31,32　量産時2kΩ
- USB
- USB green
- (near U2) USB_DPUPE
- ALM red
- 60V1A 2W hfe300 TO-243AA
- SW 1,2,3 mode
- SW 4,5 Wait
- (near TR2) output max35V500mA
- Labels drawn without touching a wire or pin: DGND
- Project Title:
- Project No:
- Size:
- Date:
- A3
- Rev:
- Page Title:
- Sheet:
- of
- (in symbol 219-8MST) ON
- (in symbol C1608) 1608
- (in symbol CJS-1201TB) ON-OFF-ON
- (in symbol DTC114YKAT146_1) 10K
- (in symbol MF2012) 2012
- (in symbol TF1608) 1608

### Library data of the parts
BOOT RESEt1 = HEDDER2 2mm: 雄,ストレート,1列2ピン; Vendor: JST
C1 C2 C8 C9 = C1608: セラコン1608サイズ; Vendor: TaiyoYuden
C3-C6 C10 C11 C15-C19 = C1608: セラコン1608サイズ; Vendor: TDK; Voltage: 50V
C7 = C1608: セラコン1608サイズ; Vendor: Murata; Voltage: 50V
C12-C14 = C1608: as C56 on sheet Amp
CN5 = B3P-SHF-1AA: 雄,ストレート,1列3ピン; Vendor: JST
JTAG1 = HEDDER12 2mm: Vendor: akiduki
L1 = MLZ2012: SMD Inductor 2012size; Vendor: TDK; Tag: 100uH
LED1 = LTST-C190CKT: LED 1608 orange; Vendor: kingbright; Color: Orange
LED2 = LTST-C190CKT: LED 1608 yellow; Vendor: kingbright; Color: yellow
LED3 = LTST-C190CKT: LED 1608 green; Vendor: kingbright; Color: green
LED4 = LTST-C190CKT: LED 1608 RED; Vendor: kingbright; Color: Red
PC1-PC4 = TLP291: PHOTOCOUPLER 1ch; Vendor: TOSHIBA
R1-R42 R45 R47 = TF1608: 厚膜チップ抵抗1608サイズ; Vendor: Panasonic
R43 R44 R46 R48 = MF2012: 薄膜チップ抵抗2012サイズ; Vendor: Panasonic
SW1 = 219-8MST: SMD DIP Switch; Vendor: CTS Electrocomponents
SW2 = CJS-1201TB: SWITCH SLIDE SPDT 100MA 6V; Vendor: Nidec Copal Electronics
TR1 TR2 = DTC114YKAT146_1: NPN  TR 1A with  Resi; Vendor: ROHM ローム
U1 = AS5F34G04SND-08LIN: IC FLASH 4GBIT SPI/QUAD I/O 8LGA; Vendor: Alliance Memory, Inc.
U2 = RX62NxxDFP  100pin: MCU; Manufactuer: Renesas; Manufactuer P/N: R5F5651EHDFP#30
U3 = LTC3245EMSE#PBF: IC REG CHARG PUMP ADJ/PRG 12MSOP; Vendor: Analog Devices Inc.
USB1 = 87583-3010RPALF: CONN RCPT USB2.0 TYPEA 4P SMD RA; Vendor: Amphenol ICC (FCI)
USBPOW1 = SS12D01G4: SPDTスライドスイッチ; Vendor: 秋月¦
VR3 VR4 = ST-32EA**: as VR2 on sheet Amp
X1 = 9HT10-32.768KDZC-T: CRYSTAL 32kHz 3.2mm x 1.5mm; Vendor: TXC CORPORATION; Capacitance: 9pF; Tolerance: 20ppm; ESR: 70k
X2 = SIT2001BI-S2-33E-xxx: OSC MEMS ＳＯＴ－２３－５; Vendor: SiTime; Stability: 25ppm

## Sheet Power.SchDoc
size A4; SheetNumber: 2; SheetTotal: 5
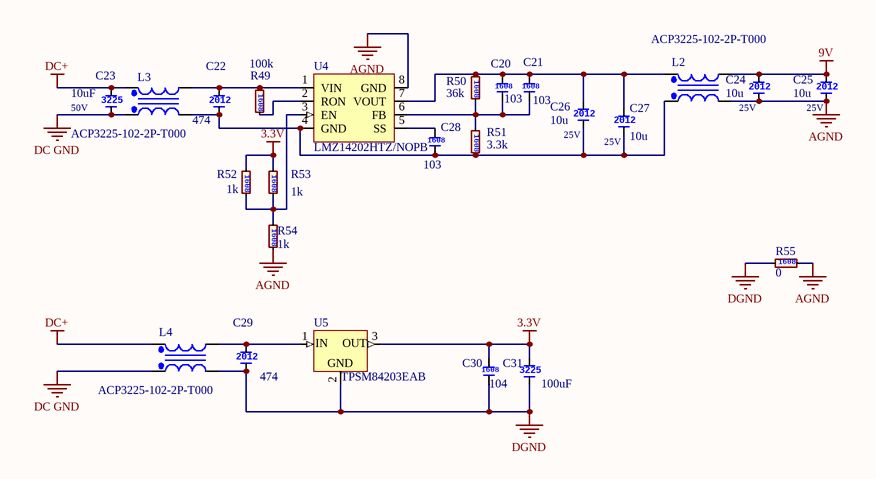
[diagram p3: Power.SchDoc]

### Parts
C20  Tag: 103  [C1608]  (hidden comment: GCD188R71H103KA01D)
C21  Tag: 103  [C1608]  (hidden comment: GCD188R71H103KA01D)
C22  Tag: 474  [C2012]  (hidden comment: GRM21BR71H474MA88)
C23  Tag: 10uF  Voltage: 50V  [C3225]  (hidden comment: UMK325C7106MM-T)
C24  Tag: 10u  Voltage: 25V  [C2012]  (hidden comment: TMK212BBJ106MG-T)
C25  Tag: 10u  Voltage: 25V  [C2012]  (hidden comment: TMK212BBJ106MG-T)
C26  Tag: 10u  Voltage: 25V  [C2012]  (hidden comment: TMK212BBJ106MG-T)
C27  Tag: 10u  Voltage: 25V  [C2012]  (hidden comment: TMK212BBJ106MG-T)
C28  Tag: 103  [C1608]  (hidden comment: GCD188R71H103KA01D)
C29  Tag: 474  [C2012]  (hidden comment: GRM21BR71H474MA88)
C30  Tag: 104  [C1608]  (hidden comment: CGA3E2X7R1H104K080AA)
C31  Tag: 100uF  [C3225]  (hidden comment: EMK325ABJ107MM-T)
L2  ACP3225-102-2P-T000  [ACM3225]
L3  ACP3225-102-2P-T000  [ACM3225]
L4  ACP3225-102-2P-T000  [ACM3225]
R49  Tag: 100k  [R1608]  (hidden comment: ERJ-PA3F1003V)
R50  Tag: 36k  [R1608]  (hidden comment: ERJ-PA3F3602V)
R51  Tag: 3.3k  [R1608]  (hidden comment: ERJ-PA3F3301V)
R52  Tag: 1k  [R1608]  (hidden comment: ERJ-PA3F1000V)
R53  Tag: 1k  [R1608]  (hidden comment: ERJ-PA3F1000V)
R54  Tag: 1k  [R1608]  (hidden comment: ERJ-PA3F1000V)
R55  Tag: 0  [R1608]  (hidden comment: ERJ-S030R00V)
U4  LMZ14202HTZ/NOPB  [TO-PMOD-7]
U5  TPSM84203EAB  [TO220-3]

### Nets
3.3V: C30.2 C31.2 R52.1 R53.1 U5.3(OUT)
9V: C24.2 C25.2 L2.4(Pri+)
AGND: C24.1 C25.1 L2.3(Pri-) R54.2 R55.2 U4.8(GND)
DC GND: C23.1 L3.2(Sec-) L4.2(Sec-)  [project net DC_GND]
DC+: C23.2 L3.1(Sec+) L4.1(Sec+)
DGND: C29.1 C30.1 C31.1 L4.3(Pri-) R55.1 U5.2(GND)
NetC20_1: C20.1 C21.1 R50.2 R51.1 U4.6(FB)
NetC20_2: C20.2 C21.2 C26.2 C27.2 L2.1(Sec+) R50.1 U4.7(VOUT)
NetC22_1: C22.1 C26.1 C27.1 C28.1 L2.2(Sec-) L3.3(Pri-) R51.2 U4.4(GND)
NetC22_2: C22.2 L3.4(Pri+) R49.1 U4.1(VIN)
NetC28_2: C28.2 U4.5(SS)
NetC29_2: C29.2 L4.4(Pri+) U5.1(IN)
NetR49_2: R49.2 U4.2(RON)
NetR52_2: R52.2 R53.2 R54.1 U4.3(EN)

### Notes on the sheet
- Project Title:
- Project No:
- Size:
- Date:
- A4
- Rev:
- Page Title:
- Sheet:
- of
- (in symbol C1608) 1608
- (in symbol C2012) 2012
- (in symbol C3225) 3225
- (in symbol TF1608) 1608

### Library data of the parts
C20 C21 C28 = C1608: as C7 on sheet MCU
C22 C29 = C2012: セラコン2012サイズ; Vendor: Murata; Voltage: 50V
C23 = C3225: セラコン3225サイズ; Vendor: *
C24-C27 = C2012: セラコン2012サイズ; Vendor: Murata
C30 = C1608: セラコン1608サイズ; Vendor: TDK; Voltage: 50V
C31 = C3225: セラコン3225サイズ; Vendor: TaiyoYuden; Voltage: 50V
L2-L4 = ACM3225: コモンモード,1A,4ピン; Vendor: TDK
R49-R55 = TF1608: 厚膜チップ抵抗1608サイズ; Vendor: Panasonic
U4 = LMZ14202HTZ/NOPB: DC DC CONVERTER 5-30V; Vendor: Texas Instruments
U5 = TPSM84203EAB: DC DC CONVERTER 3.3V; Vendor: Texas Instruments

## Sheet IO.SchDoc
size A4; SheetNumber: 5; SheetTotal: 5
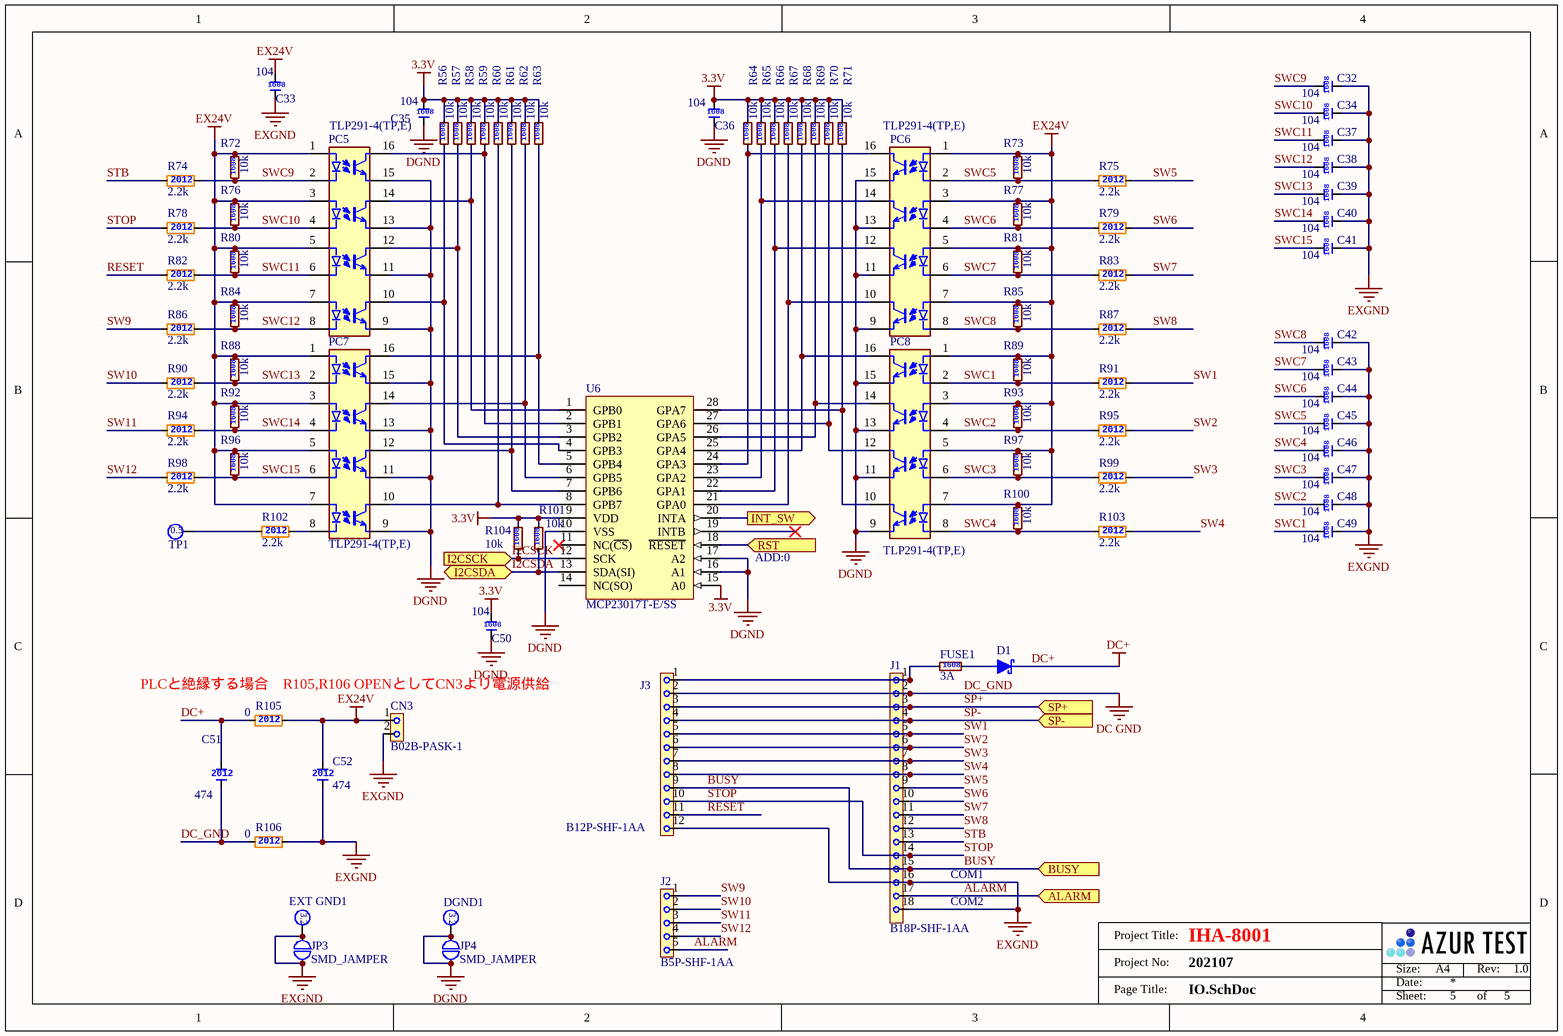
[diagram p4: IO.SchDoc]

### Parts
C32  Tag: 104  [C1608]  (hidden comment: CGA3E2X7R1H104K080AA)
C33  Tag: 104  [C1608]  (hidden comment: CGA3E2X7R1H104K080AA)
C34  Tag: 104  [C1608]  (hidden comment: CGA3E2X7R1H104K080AA)
C35  Tag: 104  [C1608]  (hidden comment: CGA3E2X7R1H104K080AA)
C36  Tag: 104  [C1608]  (hidden comment: CGA3E2X7R1H104K080AA)
C37  Tag: 104  [C1608]  (hidden comment: CGA3E2X7R1H104K080AA)
C38  Tag: 104  [C1608]  (hidden comment: CGA3E2X7R1H104K080AA)
C39  Tag: 104  [C1608]  (hidden comment: CGA3E2X7R1H104K080AA)
C40  Tag: 104  [C1608]  (hidden comment: CGA3E2X7R1H104K080AA)
C41  Tag: 104  [C1608]  (hidden comment: CGA3E2X7R1H104K080AA)
C42  Tag: 104  [C1608]  (hidden comment: CGA3E2X7R1H104K080AA)
C43  Tag: 104  [C1608]  (hidden comment: CGA3E2X7R1H104K080AA)
C44  Tag: 104  [C1608]  (hidden comment: CGA3E2X7R1H104K080AA)
C45  Tag: 104  [C1608]  (hidden comment: CGA3E2X7R1H104K080AA)
C46  Tag: 104  [C1608]  (hidden comment: CGA3E2X7R1H104K080AA)
C47  Tag: 104  [C1608]  (hidden comment: CGA3E2X7R1H104K080AA)
C48  Tag: 104  [C1608]  (hidden comment: CGA3E2X7R1H104K080AA)
C49  Tag: 104  [C1608]  (hidden comment: CGA3E2X7R1H104K080AA)
C50  Tag: 104  [C1608]  (hidden comment: CGA3E2X7R1H104K080AA)
C51  Tag: 474  [C2012]  (hidden comment: GRM21BR71H474MA88)
C52  Tag: 474  [C2012]  (hidden comment: GRM21BR71H474MA88)
CN3  B02B-PASK-1  [B02B-PASK-1]
D1  SIPS3150U  [DO-214AA]  (value not drawn)
DGND1  TP3.2mm  [TP3.2mm]  (value not drawn)  (no BOM)
EXT_GND1  TP3.2mm  [TP3.2mm]  (value not drawn)  (no BOM)
FUSE1  Tag: 3A  [R1608]  (hidden comment: ERB-RE3R00V)
J1  B18P-SHF-1AA  [B18P-SHF-1AA]
J2  B5P-SHF-1AA  [B5P-SHF-1AA]
J3  B12P-SHF-1AA  [B12P-SHF-1AA]
JP3  SMD_JAMPER  [SMD_JAMPER -Cut]  (no BOM)
JP4  SMD_JAMPER  [SMD_JAMPER -Cut]  (no BOM)
PC5  TLP291-4(TP,E)  [SO16]
PC6  TLP291-4(TP,E)  [SO16]
PC7  TLP291-4(TP,E)  [SO16]
PC8  TLP291-4(TP,E)  [SO16]
R56  Tag: 10k  [R1608]  (hidden comment: ERJ-PA3F1002V)
R57  Tag: 10k  [R1608]  (hidden comment: ERJ-PA3F1002V)
R58  Tag: 10k  [R1608]  (hidden comment: ERJ-PA3F1002V)
R59  Tag: 10k  [R1608]  (hidden comment: ERJ-PA3F1002V)
R60  Tag: 10k  [R1608]  (hidden comment: ERJ-PA3F1002V)
R61  Tag: 10k  [R1608]  (hidden comment: ERJ-PA3F1002V)
R62  Tag: 10k  [R1608]  (hidden comment: ERJ-PA3F1002V)
R63  Tag: 10k  [R1608]  (hidden comment: ERJ-PA3F1002V)
R64  Tag: 10k  [R1608]  (hidden comment: ERJ-PA3F1002V)
R65  Tag: 10k  [R1608]  (hidden comment: ERJ-PA3F1002V)
R66  Tag: 10k  [R1608]  (hidden comment: ERJ-PA3F1002V)
R67  Tag: 10k  [R1608]  (hidden comment: ERJ-PA3F1002V)
R68  Tag: 10k  [R1608]  (hidden comment: ERJ-PA3F1002V)
R69  Tag: 10k  [R1608]  (hidden comment: ERJ-PA3F1002V)
R70  Tag: 10k  [R1608]  (hidden comment: ERJ-PA3F1002V)
R71  Tag: 10k  [R1608]  (hidden comment: ERJ-PA3F1002V)
R72  Tag: 10k  [R1608]  (hidden comment: ERJ-PA3F1002V)
R73  Tag: 10k  [R1608]  (hidden comment: ERJ-PA3F1002V)
R74  Tag: 2.2k  [R2012]  (hidden comment: ERJ-P08J222V)
R75  Tag: 2.2k  [R2012]  (hidden comment: ERJ-P08J222V)
R76  Tag: 10k  [R1608]  (hidden comment: ERJ-PA3F1002V)
R77  Tag: 10k  [R1608]  (hidden comment: ERJ-PA3F1002V)
R78  Tag: 2.2k  [R2012]  (hidden comment: ERJ-P08J222V)
R79  Tag: 2.2k  [R2012]  (hidden comment: ERJ-P08J222V)
R80  Tag: 10k  [R1608]  (hidden comment: ERJ-PA3F1002V)
R81  Tag: 10k  [R1608]  (hidden comment: ERJ-PA3F1002V)
R82  Tag: 2.2k  [R2012]  (hidden comment: ERJ-P08J222V)
R83  Tag: 2.2k  [R2012]  (hidden comment: ERJ-P08J222V)
R84  Tag: 10k  [R1608]  (hidden comment: ERJ-PA3F1002V)
R85  Tag: 10k  [R1608]  (hidden comment: ERJ-PA3F1002V)
R86  Tag: 2.2k  [R2012]  (hidden comment: ERJ-P08J222V)
R87  Tag: 2.2k  [R2012]  (hidden comment: ERJ-P08J222V)
R88  Tag: 10k  [R1608]  (hidden comment: ERJ-PA3F1002V)
R89  Tag: 10k  [R1608]  (hidden comment: ERJ-PA3F1002V)
R90  Tag: 2.2k  [R2012]  (hidden comment: ERJ-P08J222V)
R91  Tag: 2.2k  [R2012]  (hidden comment: ERJ-P08J222V)
R92  Tag: 10k  [R1608]  (hidden comment: ERJ-PA3F1002V)
R93  Tag: 10k  [R1608]  (hidden comment: ERJ-PA3F1002V)
R94  Tag: 2.2k  [R2012]  (hidden comment: ERJ-P08J222V)
R95  Tag: 2.2k  [R2012]  (hidden comment: ERJ-P08J222V)
R96  Tag: 10k  [R1608]  (hidden comment: ERJ-PA3F1002V)
R97  Tag: 10k  [R1608]  (hidden comment: ERJ-PA3F1002V)
R98  Tag: 2.2k  [R2012]  (hidden comment: ERJ-P08J222V)
R99  Tag: 2.2k  [R2012]  (hidden comment: ERJ-P08J222V)
R100  Tag: 10k  [R1608]  (hidden comment: ERJ-PA3F1002V)
R101  Tag: 10k  [R1608]  (hidden comment: ERJ-PA3F1002V)
R102  Tag: 2.2k  [R2012]  (hidden comment: ERJ-P08J222V)
R103  Tag: 2.2k  [R2012]  (hidden comment: ERJ-P08J222V)
R104  Tag: 10k  [R1608]  (hidden comment: ERJ-PA3F1002V)
R105  Tag: 0  [R2012]  (hidden comment: ERJ-6GEY0R00V)
R106  Tag: 0  [R2012]  (hidden comment: ERJ-6GEY0R00V)
TP1  TP0.5mm  [TP0.5mm]  (value not drawn)  (no BOM)
U6  MCP23017T-E/SS  [SSOP28]

### Ports
ALARM (in), BUSY (in), I2CSCK (in), I2CSDA (bidir), INT_SW (out), RST (in), SP+ (in), SP- (in)

### Nets
3.3V: C35.2 C36.2 C50.2 R56.2 R57.2 R58.2 R59.2 R60.2 R61.2 R62.2 R63.2 R64.2 R65.2 R66.2 R67.2 R68.2 R69.2 R70.2 R71.2 R101.2 R104.2 U6.9(VDD) U6.15(A0)
DC+: C51.2 D1.K R105.1
DC_GND: C51.1 J1.2 J3.2 R106.1  [also labelled DC GND]
DGND: C35.1 C36.1 C50.1 DGND1.1 JP4.1 JP4.2 PC5.9(E) PC5.11(E) PC5.13(E) PC5.15(E) PC6.9(E) PC6.11(E) PC6.13(E) PC6.15(E) PC7.9(E) PC7.11(E) PC7.13(E) PC7.15(E) PC8.9(E) PC8.11(E) PC8.13(E) PC8.15(E) U6.10(VSS) U6.16(A1) U6.17(A2)
EX24V: C33.2 C52.2 CN3.1 PC5.1(A-LED) PC5.3(A-LED) PC5.5(A-LED) PC5.7(A-LED) PC6.1(A-LED) PC6.3(A-LED) PC6.5(A-LED) PC6.7(A-LED) PC7.1(A-LED) PC7.3(A-LED) PC7.5(A-LED) PC7.7(A-LED) PC8.1(A-LED) PC8.3(A-LED) PC8.5(A-LED) PC8.7(A-LED) R72.2 R73.2 R76.2 R77.2 R80.2 R81.2 R84.2 R85.2 R88.2 R89.2 R92.2 R93.2 R96.2 R97.2 R100.2 R105.2
EXGND: C32.1 C33.1 C34.1 C37.1 C38.1 C39.1 C40.1 C41.1 C42.1 C43.1 C44.1 C45.1 C46.1 C47.1 C48.1 C49.1 C52.1 CN3.2 EXT_GND1.1 J1.16 J1.18 J3.12 JP3.1 JP3.2 R106.2
ALARM: J1.17 J2.5 ; port ALARM
BUSY: J1.15 J3.9 ; port BUSY
I2CSCK: R104.1 U6.12(SCK) ; port I2CSCK
I2CSDA: R101.1 U6.13(SDA(SI)) ; port I2CSDA
INT_SW: U6.20(INTA) ; port INT_SW
RESET: J3.11 R82.1
SP+: J1.3 J3.3 ; port SP+
SP-: J1.4 J3.4 ; port SP-
STB: J1.13 R74.1
STOP: J1.14 J3.10 R78.1
SW1: J1.5 J3.5 R91.2
SW2: J1.6 J3.6 R95.2
SW3: J1.7 J3.7 R99.2
SW4: J1.8 J3.8 R103.2
SW5: J1.9 R75.2
SW6: J1.10 R79.2
SW7: J1.11 R83.2
SW8: J1.12 R87.2
SW9: J2.1 R86.1
SW10: J2.2 R90.1
SW11: J2.3 R94.1
SW12: J2.4 R98.1
SWC1: C49.2 PC8.2(K-LED) R89.1 R91.1
SWC2: C48.2 PC8.4(K-LED) R93.1 R95.1
SWC3: C47.2 PC8.6(K-LED) R97.1 R99.1
SWC4: C46.2 PC8.8(K-LED) R100.1 R103.1
SWC5: C45.2 PC6.2(K-LED) R73.1 R75.1
SWC6: C44.2 PC6.4(K-LED) R77.1 R79.1
SWC7: C43.2 PC6.6(K-LED) R81.1 R83.1
SWC8: C42.2 PC6.8(K-LED) R85.1 R87.1
SWC9: C32.2 PC5.2(K-LED) R72.1 R74.2
SWC10: C34.2 PC5.4(K-LED) R76.1 R78.2
SWC11: C37.2 PC5.6(K-LED) R80.1 R82.2
SWC12: C38.2 PC5.8(K-LED) R84.1 R86.2
SWC13: C39.2 PC7.2(K-LED) R88.1 R90.2
SWC14: C40.2 PC7.4(K-LED) R92.1 R94.2
SWC15: C41.2 PC7.6(K-LED) R96.1 R98.2
NetD1_A: D1.A FUSE1.2
NetFUSE1_1: FUSE1.1 J1.1 J3.1
NetPC5_10: PC5.10(C) R56.1 U6.4(GPB3)
NetPC5_12: PC5.12(C) R57.1 U6.3(GPB2)
NetPC5_14: PC5.14(C) R58.1 U6.1(GPB0)
NetPC5_16: PC5.16(C) R59.1 U6.2(GPB1)
NetPC6_10: PC6.10(C) R67.1 U6.21(GPA0)
NetPC6_12: PC6.12(C) R66.1 U6.22(GPA1)
NetPC6_14: PC6.14(C) R65.1 U6.23(GPA2)
NetPC6_16: PC6.16(C) R64.1 U6.24(GPA3)
NetPC7_8: PC7.8(K-LED) R102.2
NetPC7_10: PC7.10(C) R60.1 U6.8(GPB7)
NetPC7_12: PC7.12(C) R61.1 U6.7(GPB6)
NetPC7_14: PC7.14(C) R62.1 U6.6(GPB5)
NetPC7_16: PC7.16(C) R63.1 U6.5(GPB4)
NetPC8_10: PC8.10(C) R71.1 U6.28(GPA7)
NetPC8_12: PC8.12(C) R70.1 U6.27(GPA6)
NetPC8_14: PC8.14(C) R69.1 U6.26(GPA5)
NetPC8_16: PC8.16(C) R68.1 U6.25(GPA4)
NetR102_1: R102.1 TP1.1
NetU2_44: U6.18(~{RESET}) ; port RST

Not connected (* = marked no-connect by the designer): U6 11(NC(~{CS}))* 14(NC(SO)) 19(INTB)*

### Notes on the sheet
- ADD:0
- PLCと絶縁する場合　R105,R106 OPENとしてCN3より電源供給
- (near J1) COM2
- (near J1) COM1
- Project Title:
- Project No:
- Size:
- Date:
- A4
- Rev:
- Page Title:
- Sheet:
- of
- (in symbol C1608) 1608
- (in symbol C2012) 2012
- (in symbol MF2012) 2012
- (in symbol TF1608) 1608
- (in symbol TP0.5mm) 0.5
- (in symbol TP3.2mm) 3.2

### Library data of the parts
C32-C50 = C1608: セラコン1608サイズ; Vendor: TDK; Voltage: 50V
C51 C52 = C2012: as C22 on sheet Power
CN3 = B02B-PASK-1: 雄,ストレート,1列2ピン; Vendor: JST
D1 = Diode SMB 5.4x4.3: Schottky Rectifier; Vendor: STmicro; Voltage: 150V; Current: 3A
DGND1 EXT_GND1 = TP3.2mm: Test-Point 3.2mm
FUSE1 = TF1608: 3A 1608サイズ; Vendor: Panasonic
J1 = B18P-SHF-1AA: 雄,ストレート,1列12ピン PCB; Vendor: JST
J2 = B5P-SHF-1AA: 雄,ストレート,1列3ピン; Vendor: JST
J3 = B12P-SHF-1AA: 雄,ストレート,1列12ピン PCB; Vendor: JST
PC5-PC8 = TLP621: 4 Channel 16-SO; Vendor: Toshiba
R56-R73 R76 R77 R80 R81 R84 R85 R88 R89 R92 R93 R96 R97 R100 R101 R104 = TF1608: 厚膜チップ抵抗1608サイズ; Vendor: Panasonic
R74 R75 R78 R79 R82 R83 R86 R87 R90 R91 R94 R95 R98 R99 R102 R103 R105 R106 = MF2012: 薄膜チップ抵抗2012サイズ; Vendor: Panasonic
TP1 = TP0.5mm: Test-Point 0.5mm
U6 = MCP23_17T-E/SO: I/O Expander 16 SPI 10MHz 28-SOIC; Vendor: Microchip Technology

## Nets that join several sheets
3.3V: TOP (3.3V.1), Amp (U8.3), MCU (43 pins), Power (5 pins), IO (23 pins)
9V: Amp (17 pins), MCU (5 pins), Power (C24.2 C25.2 L2.4)
AGND: TOP (AGND1.1), Amp (39 pins), MCU (5 pins), Power (6 pins)
DC+: Power (C23.2 L3.1 L4.1), IO (C51.2 D1.K R105.1)
DC_GND: Power (C23.1 L3.2 L4.2), IO (C51.1 J1.2 J3.2 R106.1)
DGND: MCU (53 pins), Power (6 pins), IO (25 pins)
EX24V: MCU (PC2.1 PC4.1 R43.2 R44.2), IO (35 pins)
EXGND: MCU (TR1.3 TR2.3), IO (25 pins)
ALARM: MCU (TR2.2), IO (J1.17 J2.5)
BUSY: MCU (TR1.2), IO (J1.15 J3.9)
I2CSCK: Amp (U8.10), MCU (U2.54), IO (R104.1 U6.12)
I2CSDA: Amp (U8.1), MCU (U2.53), IO (R101.1 U6.13)
INT_SW: MCU (U2.46), IO (U6.20)
NetC58_1: Amp (C58.1 TP3.1), MCU (U2.100)
NetR123_1: Amp (R123.1), MCU (U2.39)
NetU2_44: MCU (U2.44), IO (U6.18)
SP+: Amp (C66.2 L5.2), IO (J1.3 J3.3)
SP-: Amp (C67.1 L6.2), IO (J1.4 J3.4)